# Altium project roneMotorBoard-v11.PrjPcb
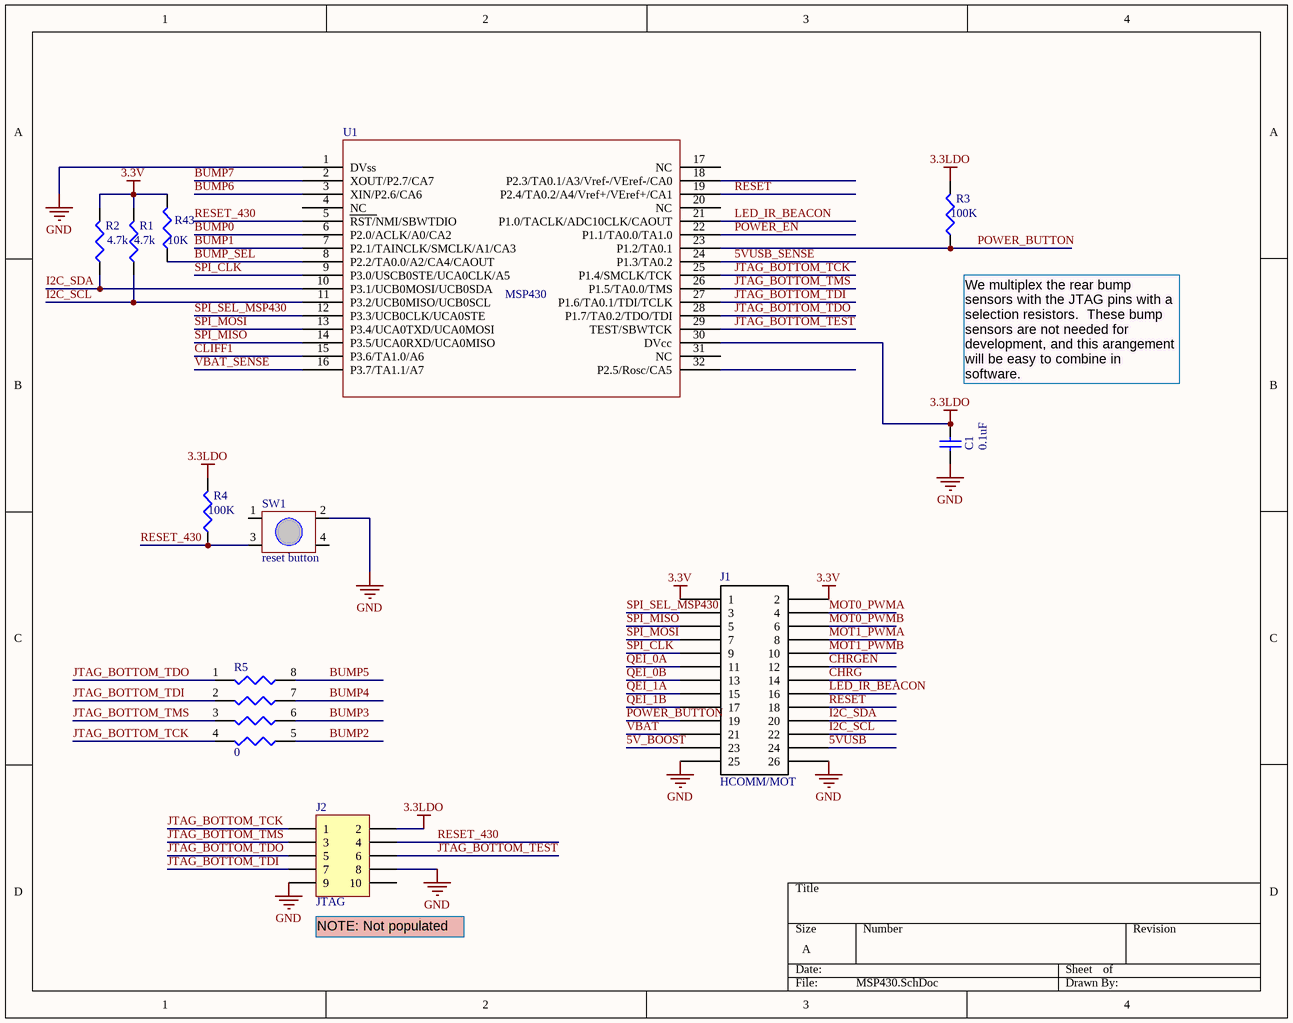
[diagram p0: MSP430.SchDoc]
6 sheets, 103 parts. Net scope: global (net labels, ports and power ports of the same name join across sheets).
Board file: roneMotorBoard-v11.PcbDoc
Sheets:
  MSP430.SchDoc
  motorEncoder.SchDoc
  Power.SchDoc
  BumpSensors.SchDoc
  GyroAccel.SchDoc
  LineCliffSensors.SchDoc

## Sheet MSP430.SchDoc
size A; SheetNumber: roneV11-msp430; SheetTotal: 6

### Parts
C1  value 0.1uF  [CAPC1005L]  (hidden comment: Cap Semi)
J1  HCOMM/MOT  [HeaderSM 13x2]
J2  JTAG  [HDR2X5]
R1  value 4.7k  [RESC1608L]  (hidden comment: Res3)
R2  value 4.7k  [RESC1608L]  (hidden comment: Res3)
R3  value 100K  [RESC1608L]  (hidden comment: Res3)
R4  value 100K  [RESC1608L]  (hidden comment: Res3)
R5  0  [4-RES ARRAY]
R43  value 10K  [RESC1608L]  (hidden comment: Res3)
SW1  reset button  [SwitchTall-TL330]
U1  MSP430  [MSP430_32PIN]

### Nets
3.3LDO: C1.2 J2.2 R3.2 R4.2 U1.30(DVcc)
3.3V: J1.1 J1.2 R1.2 R2.2 R43.2
5VUSB: J1.24
GND: C1.1 J1.25 J1.26 J2.8 J2.9 SW1.2 U1.1(DVss)
VBAT: J1.21
5V_BOOST: J1.23
5VUSB_SENSE: U1.24(P1.3/TA0.2)
BUMP0: U1.6(P2.0/ACLK/A0/CA2)
BUMP1: U1.7(P2.1/TAINCLK/SMCLK/A1/CA3)
BUMP2: R5.5
BUMP3: R5.6
BUMP4: R5.7
BUMP5: R5.8
BUMP6: U1.3(XIN/P2.6/CA6)
BUMP7: U1.2(XOUT/P2.7/CA7)
BUMP_SEL: R43.1 U1.8(P2.2/TA0.0/A2/CA4/CAOUT)
CHRG: J1.14
CHRGEN: J1.12
CLIFF1: U1.15(P3.6/TA1.0/A6)
I2C_SCL: J1.22 R1.1 U1.11(P3.2/UCB0MISO/UCB0SCL)
I2C_SDA: J1.20 R2.1 U1.10(P3.1/UCB0MOSI/UCB0SDA)
JTAG_BOTTOM_TCK: J2.1 R5.4 U1.25(P1.4/SMCLK/TCK)
JTAG_BOTTOM_TDI: J2.7 R5.2 U1.27(P1.6/TA0.1/TDI/TCLK)
JTAG_BOTTOM_TDO: J2.5 R5.1 U1.28(P1.7/TA0.2/TDO/TDI)
JTAG_BOTTOM_TEST: J2.6 U1.29(TEST/SBWTCK)
JTAG_BOTTOM_TMS: J2.3 R5.3 U1.26(P1.5/TA0.0/TMS)
LED_IR_BEACON: J1.16 U1.21(P1.0/TACLK/ADC10CLK/CAOUT)
MOT0_PWMA: J1.4
MOT0_PWMB: J1.6
MOT1_PWMA: J1.8
MOT1_PWMB: J1.10
POWER_BUTTON: J1.19 R3.1 U1.23(P1.2/TA0.1)
POWER_EN: U1.22(P1.1/TA0.0/TA1.0)
QEI_0A: J1.11
QEI_0B: J1.13
QEI_1A: J1.15
QEI_1B: J1.17
RESET: J1.18 U1.19(P2.4/TA0.2/A4/Vref+/VEref+/CA1)
RESET_430: J2.4 R4.1 SW1.3 U1.5(RST/NMI/SBWTDIO)
SPI_CLK: J1.9 U1.9(P3.0/USCB0STE/UCA0CLK/A5)
SPI_MISO: J1.5 U1.14(P3.5/UCA0RXD/UCA0MISO)
SPI_MOSI: J1.7 U1.13(P3.4/UCA0TXD/UCA0MOSI)
SPI_SEL_MSP430: J1.3 U1.12(P3.3/UCB0CLK/UCA0STE)
VBAT_SENSE: U1.16(P3.7/TA1.1/A7)

Not connected (* = marked no-connect by the designer): J2 10; SW1 1 4; U1 4(NC) 17(NC) 18(P2.3/TA0.1/A3/Vref-/VEref-/CA0) 20(NC) 31(NC) 32(P2.5/Rosc/CA5)

### Notes on the sheet
- We multiplex the rear bump sensors with the JTAG pins with a selection resistors.  These bump sensors are not needed for development, and this arangement will be easy to combine in software.
- (near J2) NOTE: Not populated

### Library data of the parts
C1 = Cap Semi: Capacitor (Semiconductor SIM Model); Published: 8-Jun-2000; LatestRevisionDate: 29-May-2009; LatestRevisionNote: IPC-7351 Footprint Added.; PackageReference: C1206; Publisher: Altium Limited; PackageDescription: Chip Capacitor
J1 = HCOMM/HMOT: Header, 2X20, 50mil, IDC
J2 = Header 5X2: Header, 5-Pin, Dual row; LatestRevisionDate: 17-Jul-2002; LatestRevisionNote: Re-released for DXP Platform.; Publisher: Altium Limited
R1-R4 R43 = Res3: Resistor; Published: 8-Jun-2000; LatestRevisionDate: 29-May-2009; LatestRevisionNote: IPC-7351 Footprint Added.; PackageReference: J1-0603; Publisher: Altium Limited; PackageDescription: Chip Resistor
R5 = 4 Res Array
SW1 = Switch-TL330
U1 = MSP430_32pin

## Sheet motorEncoder.SchDoc: r-one Motor
size A; Date: 08/09/2011; DrawnBy: MRSL; Engineer: MRSL; Organization: Rice University; Revision: V11; SheetNumber: roneV11-motorEncoder; SheetTotal: 6; DocumentName: RoneV11-motorEncoder
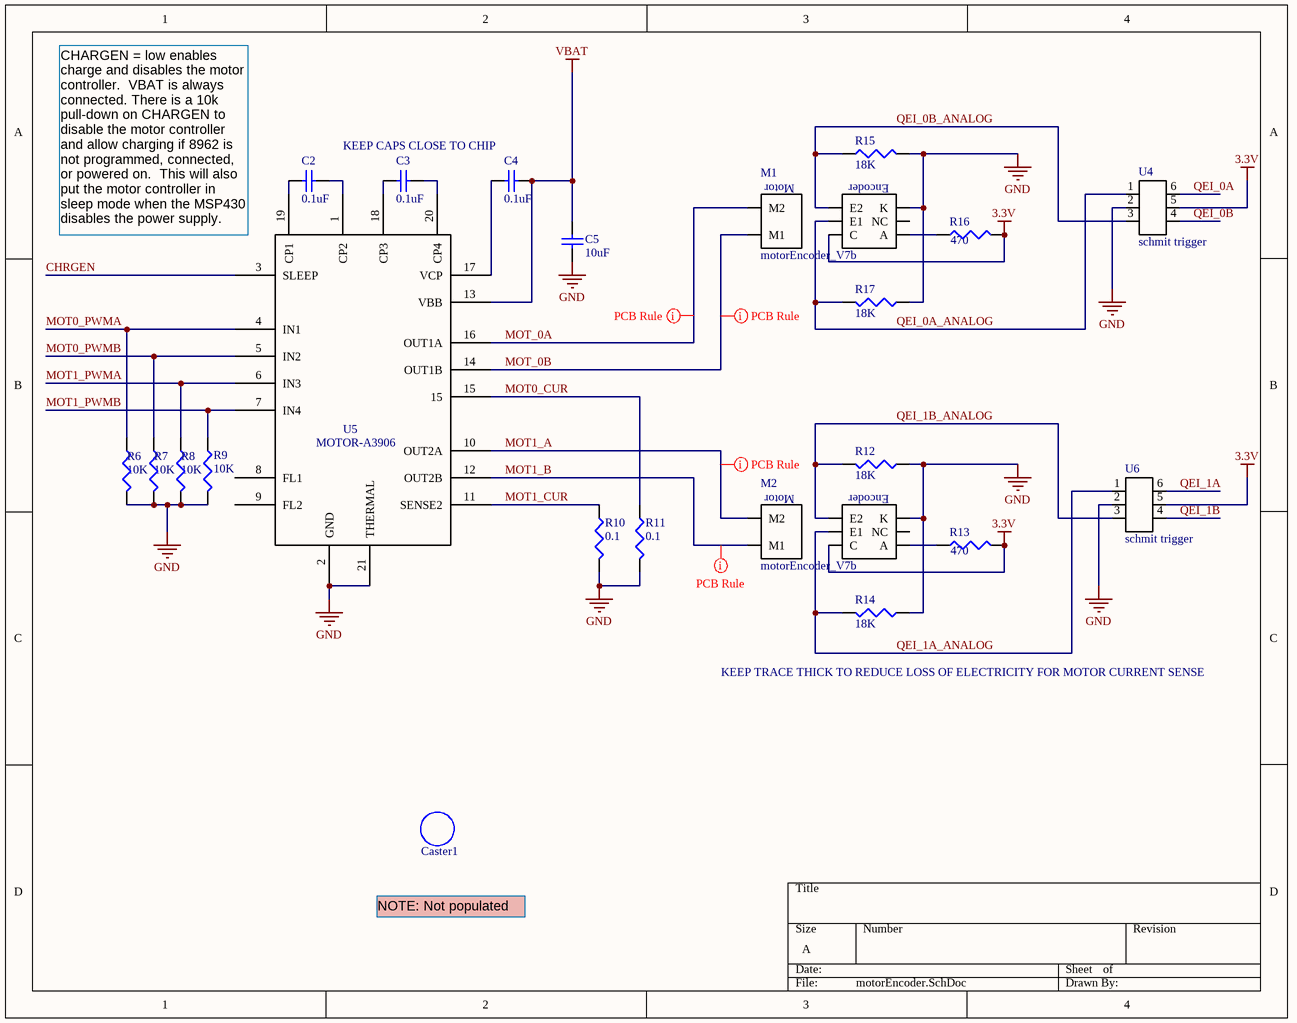
[diagram p1: motorEncoder.SchDoc]

### Parts
C2  value 0.1uF  [CAPC1005L]  (hidden comment: Cap Semi)
C3  value 0.1uF  [CAPC1005L]  (hidden comment: Cap Semi)
C4  value 0.1uF  [CAPC1005L]  (hidden comment: Cap Semi)
C5  value 10uF  [CAPC1608L]  (hidden comment: Cap Semi)
Caster1  non connect  [3/4"CASTER2]  (value not drawn)
M1  motorEncoder_V7b  [motorEncoder_V7b]
M2  motorEncoder_V7b  [motorEncoder_V7b]
R6  value 10K  [RESC1608L]  (hidden comment: Res3)
R7  value 10K  [RESC1608L]  (hidden comment: Res3)
R8  value 10K  [RESC1608L]  (hidden comment: Res3)
R9  value 10K  [RESC1608L]  (hidden comment: Res3)
R10  value 0.1  [RESC1608L]  (hidden comment: Res3)
R11  value 0.1  [RESC1608L]  (hidden comment: Res3)
R12  value 18K  [RESC1608L]
R13  value 470  [RESC1608L]
R14  value 18K  [RESC1608L]
R15  value 18K  [RESC1608L]
R16  value 470  [RESC1608L]
R17  value 18K  [RESC1608L]
U4  schmit trigger  [DCK(R-PDSO-C6)]
U5  MOTOR-A3906  [QFN-20]
U6  schmit trigger  [DCK(R-PDSO-C6)]

### Nets
3.3V: M1.C M2.C R13.2 R16.2 U4.5 U6.5
GND: C5.1 M1.K M2.K R6.2 R7.2 R8.2 R9.2 R10.2 R11.2 R12.1 R14.1 R15.2 R17.1 U4.2 U5.2(GND) U5.21(THERMAL) U6.2
VBAT: C4.1 C5.2 U5.13(VBB)
CHRGEN: U5.3(SLEEP)
MOT0_CUR: R11.1 U5.15
MOT0_PWMA: R6.1 U5.4(IN1)
MOT0_PWMB: R7.1 U5.5(IN2)
MOT1_A: M2.M2 U5.10(OUT2A)
MOT1_B: M2.M1 U5.12(OUT2B)
MOT1_CUR: R10.1 U5.11(SENSE2)
MOT1_PWMA: R8.1 U5.6(IN3)
MOT1_PWMB: R9.1 U5.7(IN4)
MOT_0A: M1.M2 U5.16(OUT1A)
MOT_0B: M1.M1 U5.14(OUT1B)
QEI_0A: U4.6
QEI_0A_ANALOG: M1.E1 R17.2 U4.1
QEI_0B: U4.4
QEI_0B_ANALOG: M1.E2 R15.1 U4.3
QEI_1A: U6.6
QEI_1A_ANALOG: M2.E1 R14.2 U6.1
QEI_1B: U6.4
QEI_1B_ANALOG: M2.E2 R12.2 U6.3
NetC2_1: C2.1 U5.19(CP1)
NetC2_2: C2.2 U5.1(CP2)
NetC3_1: C3.1 U5.18(CP3)
NetC3_2: C3.2 U5.20(CP4)
NetC4_2: C4.2 U5.17(VCP)
NetM1_A: M1.A R16.1
NetM2_A: M2.A R13.1

Not connected (* = marked no-connect by the designer): M1 NC; M2 NC; U5 8(FL1) 9(FL2)

### Layout directives
rule Width Constraint [Pref Width = 20mil    Min Width = 10mil    Max Width = 25mil]: MOT1_A, MOT1_B, MOT_0A, MOT_0B

### Notes on the sheet
- KEEP CAPS CLOSE TO CHIP
- (near U5) CHARGEN = low enables charge and disables the motor controller.  VBAT is always connected. There is a 10k pull-down on CHARGEN to disable the motor controller and allow charging if 8962 is not programmed, connected, or powered on.  This will also put the motor controller in sleep mode when the MSP430 disables the power supply.
- KEEP TRACE THICK TO REDUCE LOSS OF ELECTRICITY FOR MOTOR CURRENT SENSE
- NOTE: Not populated
- (in symbol motorEncoder_V7b) Motor; Encoder

### Library data of the parts
C2-C5 = Cap Semi: Capacitor (Semiconductor SIM Model); Published: 8-Jun-2000; LatestRevisionDate: 29-May-2009; LatestRevisionNote: IPC-7351 Footprint Added.; PackageReference: C1206; Publisher: Altium Limited; PackageDescription: Chip Capacitor
Caster1 = Caster 3/4in: This is just a space saver to get the caster onto the pcb
R6-R17 = Res3: Resistor; Published: 8-Jun-2000; LatestRevisionDate: 29-May-2009; LatestRevisionNote: IPC-7351 Footprint Added.; PackageReference: J1-0603; Publisher: Altium Limited; PackageDescription: Chip Resistor

## Sheet Power.SchDoc
size A; SheetNumber: roneV11-Power; SheetTotal: 6
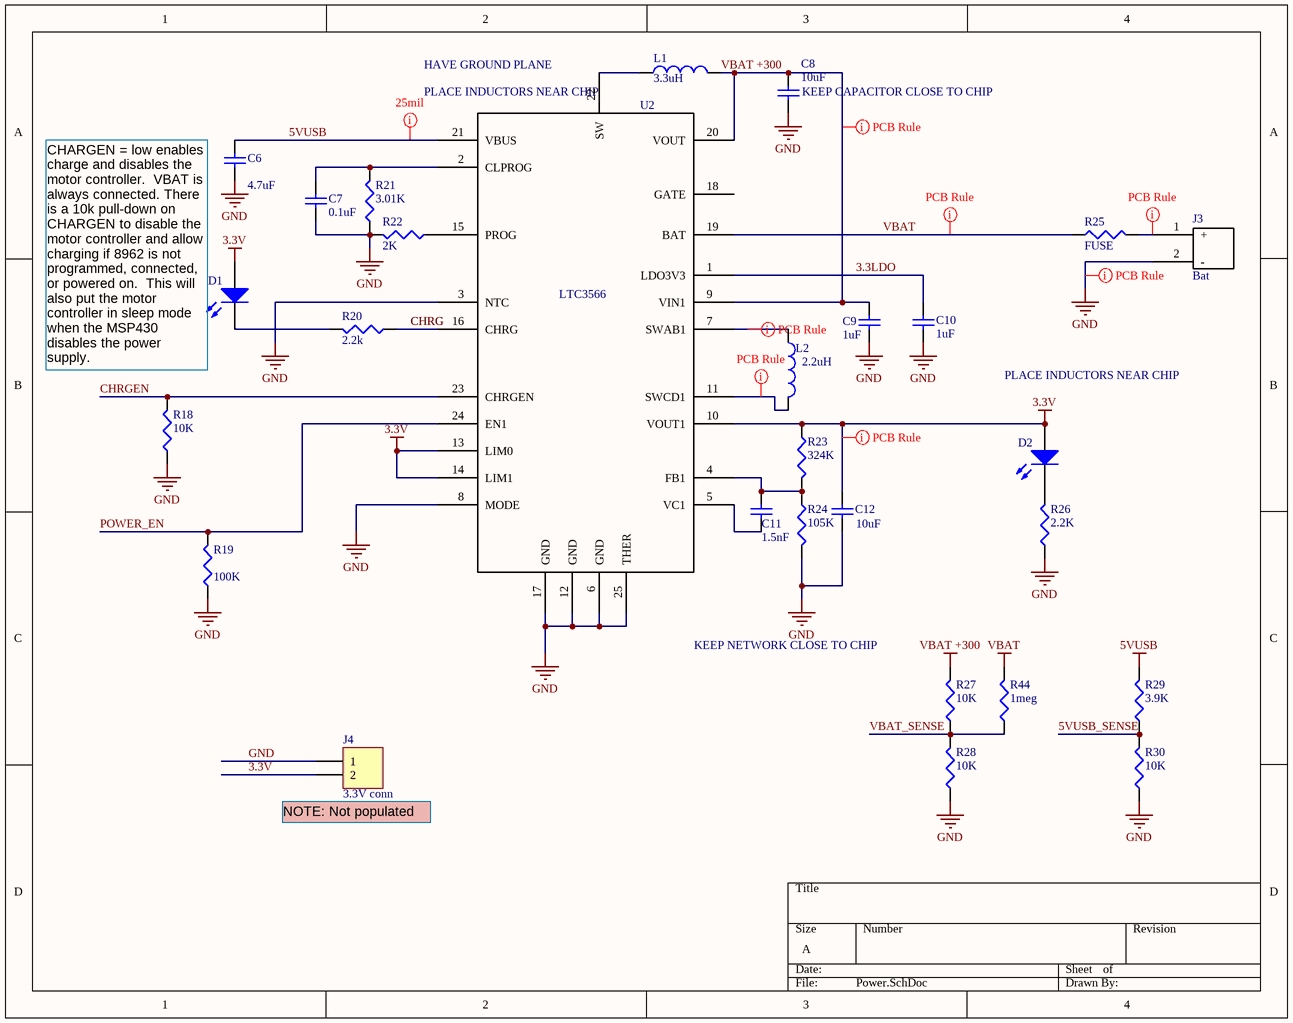
[diagram p2: Power.SchDoc]

### Parts
C6  value 4.7uF  [CAPC1005L]  (hidden comment: Cap Semi)
C7  value 0.1uF  [CAPC1005L]  (hidden comment: Cap)
C8  value 10uF  [CAPC1608L]  (hidden comment: Cap)
C9  value 1uF  [CAPC1608L]  (hidden comment: Cap)
C10  value 1uF  [CAPC1608L]  (hidden comment: Cap)
C11  value 1.5nF  [CAPC1005L]  (hidden comment: Cap)
C12  value 10uF  [CAPC1608L]  (hidden comment: Cap)
D1  Charge  [INDC2012L]  (value not drawn)
D2  Power  [INDC2012L]  (value not drawn)
J3  Bat  [BatteryConnJST]
J4  3.3V conn  [HDR1X2]
L1  3.3uH  [IndPow]
L2  2.2uH  [IndPow]
R18  value 10K  [RESC1608L]  (hidden comment: Res3)
R19  value 100K  [RESC1608L]  (hidden comment: Res3)
R20  value 2.2k  [RESC1608L]  (hidden comment: Res3)
R21  value 3.01K  [RESC1608L]  (hidden comment: Res3)
R22  value 2K  [RESC1608L]  (hidden comment: Res3)
R23  value 324K  [RESC1608L]  (hidden comment: Res3)
R24  value 105K  [RESC1608L]  (hidden comment: Res3)
R25  value FUSE  [RESC3225L]  (hidden comment: Res3)
R26  value 2.2K  [RESC1608L]  (hidden comment: Res3)
R27  value 10K  [RESC1608L]  (hidden comment: Res3)
R28  value 10K  [RESC1608L]  (hidden comment: Res3)
R29  value 3.9K  [RESC1608L]  (hidden comment: Res3)
R30  value 10K  [RESC1608L]  (hidden comment: Res3)
R44  value 1meg  [RESC1608L]  (hidden comment: Res3)
U2  LTC3566  [QFN-24]

### Nets
3.3LDO: C10.1 U2.1(LDO3V3)
3.3V: C12.2 D1.1(A) D2.1(A) J4.2 R23.1 U2.10(VOUT1) U2.13(LIM0) U2.14(LIM1)
5VUSB: C6.2 R29.2 U2.21(VBUS)
GND: C6.1 C7.1 C8.1 C9.2 C10.2 C12.1 J3.2(-) J4.1 R18.1 R19.1 R21.1 R22.2 R24.2 R26.1 R28.1 R30.1 U2.3(NTC) U2.6(GND) U2.8(MODE) U2.12(GND) U2.17(GND) U2.25(THER)
VBAT: R25.1 R44.2 U2.19(BAT)
VBAT +300: C8.2 C9.1 L1.2 R27.2 U2.9(VIN1) U2.20(VOUT)
5VUSB_SENSE: R29.1 R30.2
CHRG: R20.1 U2.16(CHRG)
CHRGEN: R18.2 U2.23(CHRGEN)
POWER_EN: R19.2 U2.24(EN1)
VBAT_SENSE: R27.1 R28.2 R44.1
NetC7_2: C7.2 R21.2 U2.2(CLPROG)
NetC11_1: C11.1 R23.2 R24.1 U2.4(FB1)
NetC11_2: C11.2 U2.5(VC1)
NetD1_2: D1.2(K) R20.2
NetD2_2: D2.2(K) R26.2
NetJ3_1: J3.1(+) R25.2
NetL1_1: L1.1 U2.22(SW)
NetL2_1: L2.1 U2.7(SWAB1)
NetL2_2: L2.2 U2.11(SWCD1)
NetR22_1: R22.1 U2.15(PROG)

Not connected (* = marked no-connect by the designer): U2 18(GATE)

### Layout directives
rule Width Constraint [Pref Width = 25mil    Min Width = 10mil    Max Width = 25mil]: 5VUSB, GND, NetJ3_1, NetL2_1, NetL2_2, VBAT +300
rule Width Constraint [Pref Width = 25mil    Min Width = 10mil    Max Width = 100mil]: 3.3V
rule Width Constraint [Pref Width = 25mil    Min Width = 10mil    Max Width = 50mil]: VBAT

### Notes on the sheet
- (near U2) HAVE GROUND PLANE
- (near U2) PLACE INDUCTORS NEAR CHIP
- (near C8) KEEP CAPACITOR CLOSE TO CHIP
- CHARGEN = low enables charge and disables the motor controller.  VBAT is always connected. There is a 10k pull-down on CHARGEN to disable the motor controller and allow charging if 8962 is not programmed, connected, or powered on.  This will also put the motor controller in sleep mode when the MSP430 disables the power supply.
- CHRG
- PLACE INDUCTORS NEAR CHIP
- KEEP NETWORK CLOSE TO CHIP
- (near J4) NOTE: Not populated

### Library data of the parts
C6 = Cap Semi: Capacitor (Semiconductor SIM Model); Published: 8-Jun-2000; LatestRevisionDate: 29-May-2009; LatestRevisionNote: IPC-7351 Footprint Added.; PackageReference: C1206; Publisher: Altium Limited; PackageDescription: Chip Capacitor
C7-C12 = Cap: Capacitor; Published: 8-Jun-2000; LatestRevisionDate: 17-Jul-2002; LatestRevisionNote: Re-released for DXP Platform.; PackageReference: RAD-0.3; Publisher: Altium Limited
D1 D2 = LED2: Typical RED, GREEN, YELLOW, AMBER GaAs LED; Published: 8-Jun-2000; LatestRevisionDate: 17-Jul-2002; LatestRevisionNote: Re-released for DXP Platform.; PackageVersion: Feb-2002; PackageReference: 3.2X1.6X1.1; Publisher: Altium Limited
J3 = BatteryConnJST
J4 = Header 2: Header, 2-Pin; LatestRevisionDate: 17-Jul-2002; LatestRevisionNote: Re-released for DXP Platform.; Publisher: Altium Limited
L1 L2 = Inductor
  L1: Value: 3.3uH
  L2: Value: 2.2uH
R18-R30 R44 = Res3: Resistor; Published: 8-Jun-2000; LatestRevisionDate: 29-May-2009; LatestRevisionNote: IPC-7351 Footprint Added.; PackageReference: J1-0603; Publisher: Altium Limited; PackageDescription: Chip Resistor

## Sheet BumpSensors.SchDoc
size A; SheetNumber: roneV11-BumpSensors; SheetTotal: 6
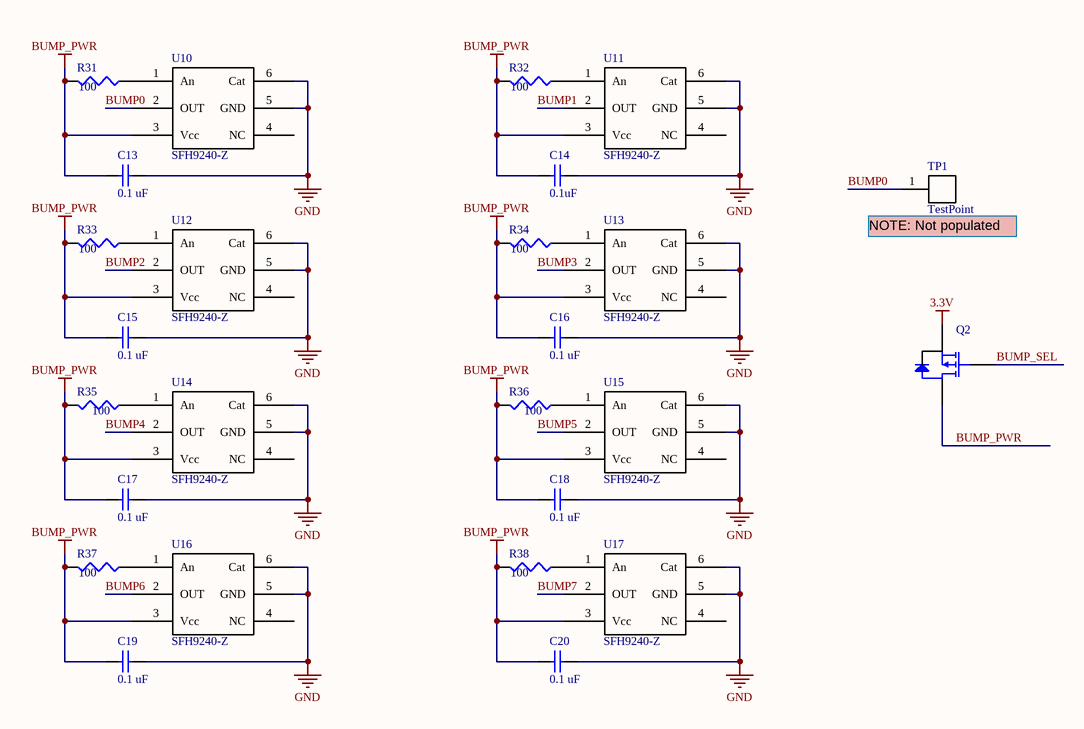
[diagram p3: BumpSensors.SchDoc]

### Parts
C13  value 0.1 uF  [CAPC1005L]  (hidden comment: Cap Semi)
C14  value 0.1uF  [CAPC1005L]  (hidden comment: Cap Semi)
C15  value 0.1 uF  [CAPC1005L]  (hidden comment: Cap Semi)
C16  value 0.1 uF  [CAPC1005L]  (hidden comment: Cap Semi)
C17  value 0.1 uF  [CAPC1005L]  (hidden comment: Cap Semi)
C18  value 0.1 uF  [CAPC1005L]  (hidden comment: Cap Semi)
C19  value 0.1 uF  [CAPC1005L]  (hidden comment: Cap Semi)
C20  value 0.1 uF  [CAPC1005L]  (hidden comment: Cap Semi)
Q2  P-Mosfet  [SOT-23]  (value not drawn)
R31  value 100  [RESC1608L]  (hidden comment: Res3)
R32  value 100  [RESC1608L]  (hidden comment: Res3)
R33  value 100  [RESC1608L]  (hidden comment: Res3)
R34  value 100  [RESC1608L]  (hidden comment: Res3)
R35  value 100  [RESC1608L]  (hidden comment: Res3)
R36  value 100  [RESC1608L]  (hidden comment: Res3)
R37  value 100  [RESC1608L]  (hidden comment: Res3)
R38  value 100  [RESC1608L]  (hidden comment: Res3)
TP1  TestPoint  [TestPoint]
U10  SFH9240-Z  [SFH9240-Z]
U11  SFH9240-Z  [SFH9240-Z]
U12  SFH9240-Z  [SFH9240-Z]
U13  SFH9240-Z  [SFH9240-Z]
U14  SFH9240-Z  [SFH9240-Z]
U15  SFH9240-Z  [SFH9240-Z]
U16  SFH9240-Z  [SFH9240-Z]
U17  SFH9240-Z  [SFH9240-Z]

### Nets
3.3V: Q2.2(S)
BUMP_PWR: C13.2 C14.2 C15.2 C16.2 C17.2 C18.2 C19.2 C20.2 Q2.3(D) R31.2 R32.2 R33.2 R34.2 R35.2 R36.2 R37.2 R38.2 U10.3(Vcc) U11.3(Vcc) U12.3(Vcc) U13.3(Vcc) U14.3(Vcc) U15.3(Vcc) U16.3(Vcc) U17.3(Vcc)
GND: C13.1 C14.1 C15.1 C16.1 C17.1 C18.1 C19.1 C20.1 U10.5(GND) U10.6(Cat) U11.5(GND) U11.6(Cat) U12.5(GND) U12.6(Cat) U13.5(GND) U13.6(Cat) U14.5(GND) U14.6(Cat) U15.5(GND) U15.6(Cat) U16.5(GND) U16.6(Cat) U17.5(GND) U17.6(Cat)
BUMP0: TP1.1 U10.2(OUT)
BUMP1: U11.2(OUT)
BUMP2: U12.2(OUT)
BUMP3: U13.2(OUT)
BUMP4: U14.2(OUT)
BUMP5: U15.2(OUT)
BUMP6: U16.2(OUT)
BUMP7: U17.2(OUT)
BUMP_SEL: Q2.1(G)
NetR31_1: R31.1 U10.1(An)
NetR32_1: R32.1 U11.1(An)
NetR33_1: R33.1 U12.1(An)
NetR34_1: R34.1 U13.1(An)
NetR35_1: R35.1 U14.1(An)
NetR36_1: R36.1 U15.1(An)
NetR37_1: R37.1 U16.1(An)
NetR38_1: R38.1 U17.1(An)

Not connected (* = marked no-connect by the designer): U10 4(NC); U11 4(NC); U12 4(NC); U13 4(NC); U14 4(NC); U15 4(NC); U16 4(NC); U17 4(NC)

### Notes on the sheet
- (near TP1) NOTE: Not populated

### Library data of the parts
C13-C20 = Cap Semi: Capacitor (Semiconductor SIM Model); Published: 8-Jun-2000; LatestRevisionDate: 29-May-2009; LatestRevisionNote: IPC-7351 Footprint Added.; PackageReference: C1206; Publisher: Altium Limited; PackageDescription: Chip Capacitor
R31-R38 = Res3: Resistor; Published: 8-Jun-2000; LatestRevisionDate: 29-May-2009; LatestRevisionNote: IPC-7351 Footprint Added.; PackageReference: J1-0603; Publisher: Altium Limited; PackageDescription: Chip Resistor

## Sheet GyroAccel.SchDoc
size A; SheetNumber: roneV11-GyroAccel; SheetTotal: 6
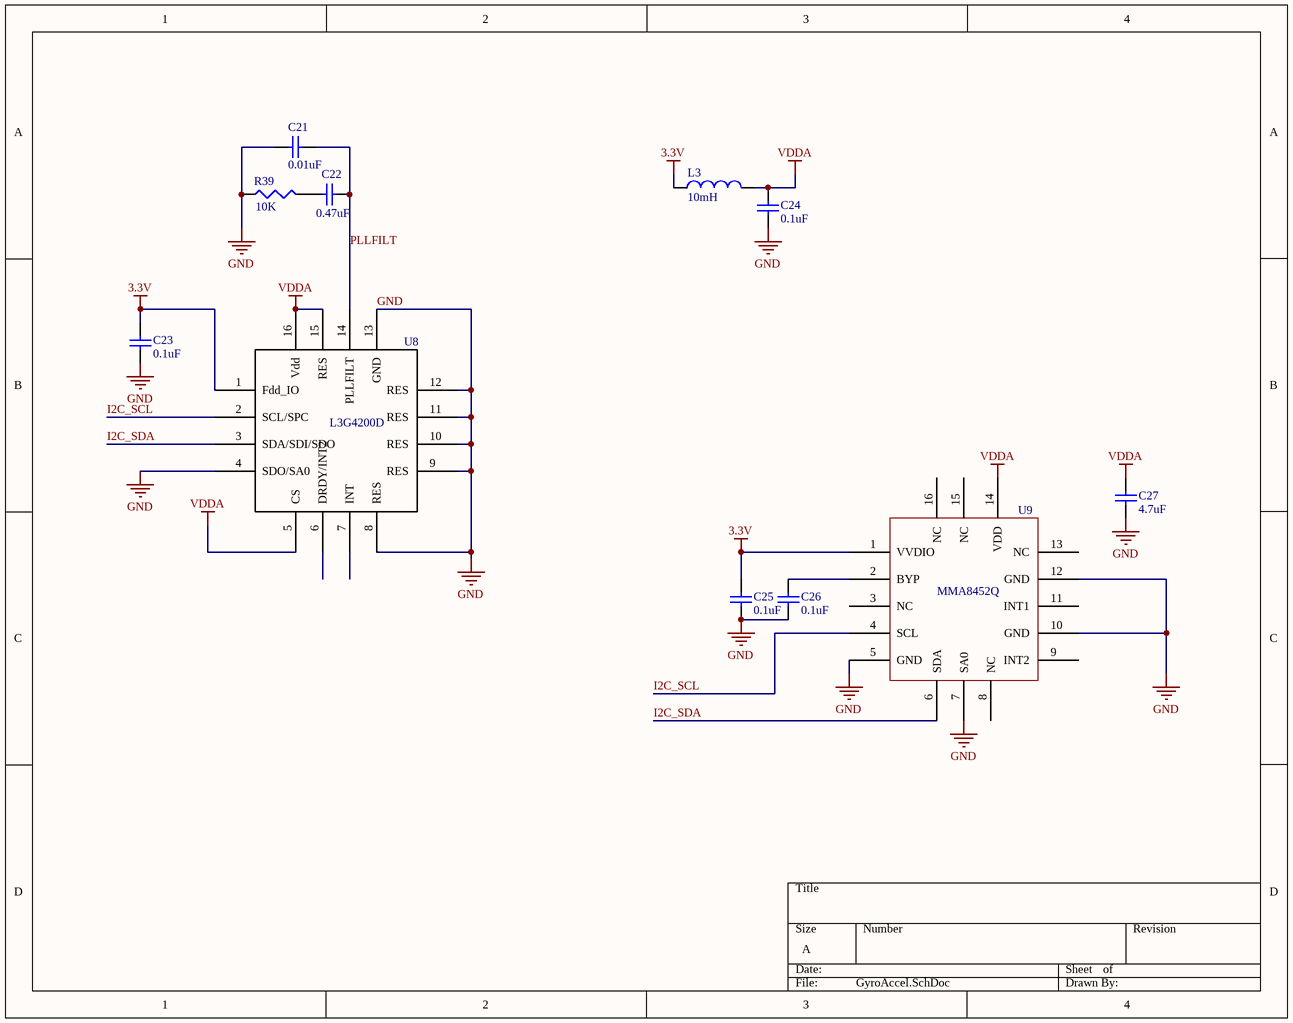
[diagram p4: GyroAccel.SchDoc]

### Parts
C21  value 0.01uF  [CAPC1005L]  (hidden comment: Cap Semi)
C22  value 0.47uF  [CAPC1005L]  (hidden comment: Cap Semi)
C23  value 0.1uF  [CAPC1005L]  (hidden comment: Cap Semi)
C24  value 0.1uF  [CAPC1005L]  (hidden comment: Cap Semi)
C25  value 0.1uF  [CAPC1005L]  (hidden comment: Cap Semi)
C26  value 0.1uF  [CAPC1005L]  (hidden comment: Cap Semi)
C27  value 4.7uF  [CAPC1005L]  (hidden comment: Cap Semi)
L3  value 10mH  [INDC2012L]  (hidden comment: Inductor)
R39  value 10K  [RESC1608L]  (hidden comment: Res3)
U8  L3G4200D  [L3G2004D]
U9  MMA8452Q  [MMA8452Q]

### Nets
3.3V: C23.2 C25.2 L3.2 U8.1(Fdd_IO) U9.1(VVDIO)
GND: C21.2 C23.1 C24.1 C25.1 C26.1 C27.1 R39.1 U8.4(SDO/SA0) U8.8(RES) U8.9(RES) U8.10(RES) U8.11(RES) U8.12(RES) U8.13(GND) U9.5(GND) U9.7(SA0) U9.10(GND) U9.12(GND)
VDDA: C24.2 C27.2 L3.1 U8.5(CS) U8.15(RES) U8.16(Vdd) U9.14(VDD)
I2C_SCL: U8.2(SCL/SPC) U9.4(SCL)
I2C_SDA: U8.3(SDA/SDI/SDO) U9.6(SDA)
PLLFILT: C21.1 C22.1 U8.14(PLLFILT)
NetC22_2: C22.2 R39.2
NetC26_2: C26.2 U9.2(BYP)

Not connected (* = marked no-connect by the designer): U8 6(DRDY/INT2) 7(INT); U9 3(NC) 8(NC) 9(INT2) 11(INT1) 13(NC) 15(NC) 16(NC)

### Library data of the parts
C21-C27 = Cap Semi: Capacitor (Semiconductor SIM Model); Published: 8-Jun-2000; LatestRevisionDate: 29-May-2009; LatestRevisionNote: IPC-7351 Footprint Added.; PackageReference: C1206; Publisher: Altium Limited; PackageDescription: Chip Capacitor
L3 = Inductor: Code_IEC: 1005; Published: 8-Jun-2000; LatestRevisionDate: 29-May-2009; LatestRevisionNote: IPC-7351 Footprint Added.; PackageReference: 0402-A; Publisher: Altium Limited; PackageDescription: Chip Inductor; Code_JEITA: 0402
R39 = Res3: Resistor; Published: 8-Jun-2000; LatestRevisionDate: 29-May-2009; LatestRevisionNote: IPC-7351 Footprint Added.; PackageReference: J1-0603; Publisher: Altium Limited; PackageDescription: Chip Resistor
U8 = L3G4200D: 3axis gyroscope, SPI

## Sheet LineCliffSensors.SchDoc
size A; SheetNumber: roneV11-LineCliffSensors; SheetTotal: 6
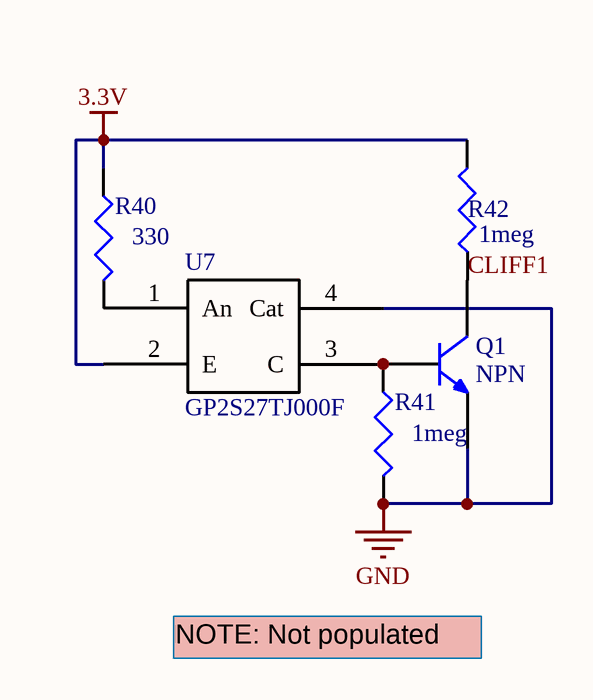
[diagram p5: LineCliffSensors.SchDoc]

### Parts
Q1  NPN  [SOT-23]
R40  value 330  [RESC1608L]  (hidden comment: Res3)
R41  value 1meg  [RESC1608L]  (hidden comment: Res3)
R42  value 1meg  [RESC1608L]  (hidden comment: Res3)
U7  GP2S27TJ000F  [GP2S27J0000F]

### Nets
3.3V: R40.1 R42.2 U7.2(E)
GND: Q1.2(E) R41.2 U7.4(Cat)
CLIFF1: Q1.3(C) R42.1
NetQ1_1: Q1.1(B) R41.1 U7.3(C)
NetR40_2: R40.2 U7.1(An)

### Notes on the sheet
- NOTE: Not populated

### Library data of the parts
R40-R42 = Res3: Resistor; Published: 8-Jun-2000; LatestRevisionDate: 29-May-2009; LatestRevisionNote: IPC-7351 Footprint Added.; PackageReference: J1-0603; Publisher: Altium Limited; PackageDescription: Chip Resistor

## Nets that join several sheets
3.3LDO: MSP430 (5 pins), Power (C10.1 U2.1)
3.3V: MSP430 (5 pins), motorEncoder (6 pins), Power (8 pins), BumpSensors (Q2.2), GyroAccel (5 pins), LineCliffSensors (R40.1 R42.2 U7.2)
5VUSB: MSP430 (J1.24), Power (C6.2 R29.2 U2.21)
GND: MSP430 (7 pins), motorEncoder (17 pins), Power (22 pins), BumpSensors (24 pins), GyroAccel (18 pins), LineCliffSensors (Q1.2 R41.2 U7.4)
VBAT: MSP430 (J1.21), motorEncoder (C4.1 C5.2 U5.13), Power (R25.1 R44.2 U2.19)
5VUSB_SENSE: MSP430 (U1.24), Power (R29.1 R30.2)
BUMP0: MSP430 (U1.6), BumpSensors (TP1.1 U10.2)
BUMP1: MSP430 (U1.7), BumpSensors (U11.2)
BUMP2: MSP430 (R5.5), BumpSensors (U12.2)
BUMP3: MSP430 (R5.6), BumpSensors (U13.2)
BUMP4: MSP430 (R5.7), BumpSensors (U14.2)
BUMP5: MSP430 (R5.8), BumpSensors (U15.2)
BUMP6: MSP430 (U1.3), BumpSensors (U16.2)
BUMP7: MSP430 (U1.2), BumpSensors (U17.2)
BUMP_SEL: MSP430 (R43.1 U1.8), BumpSensors (Q2.1)
CHRG: MSP430 (J1.14), Power (R20.1 U2.16)
CHRGEN: MSP430 (J1.12), motorEncoder (U5.3), Power (R18.2 U2.23)
CLIFF1: MSP430 (U1.15), LineCliffSensors (Q1.3 R42.1)
I2C_SCL: MSP430 (J1.22 R1.1 U1.11), GyroAccel (U8.2 U9.4)
I2C_SDA: MSP430 (J1.20 R2.1 U1.10), GyroAccel (U8.3 U9.6)
MOT0_PWMA: MSP430 (J1.4), motorEncoder (R6.1 U5.4)
MOT0_PWMB: MSP430 (J1.6), motorEncoder (R7.1 U5.5)
MOT1_PWMA: MSP430 (J1.8), motorEncoder (R8.1 U5.6)
MOT1_PWMB: MSP430 (J1.10), motorEncoder (R9.1 U5.7)
POWER_EN: MSP430 (U1.22), Power (R19.2 U2.24)
QEI_0A: MSP430 (J1.11), motorEncoder (U4.6)
QEI_0B: MSP430 (J1.13), motorEncoder (U4.4)
QEI_1A: MSP430 (J1.15), motorEncoder (U6.6)
QEI_1B: MSP430 (J1.17), motorEncoder (U6.4)
VBAT_SENSE: MSP430 (U1.16), Power (R27.1 R28.2 R44.1)